# Altium project Digi_PID_Controller.PrjPcb
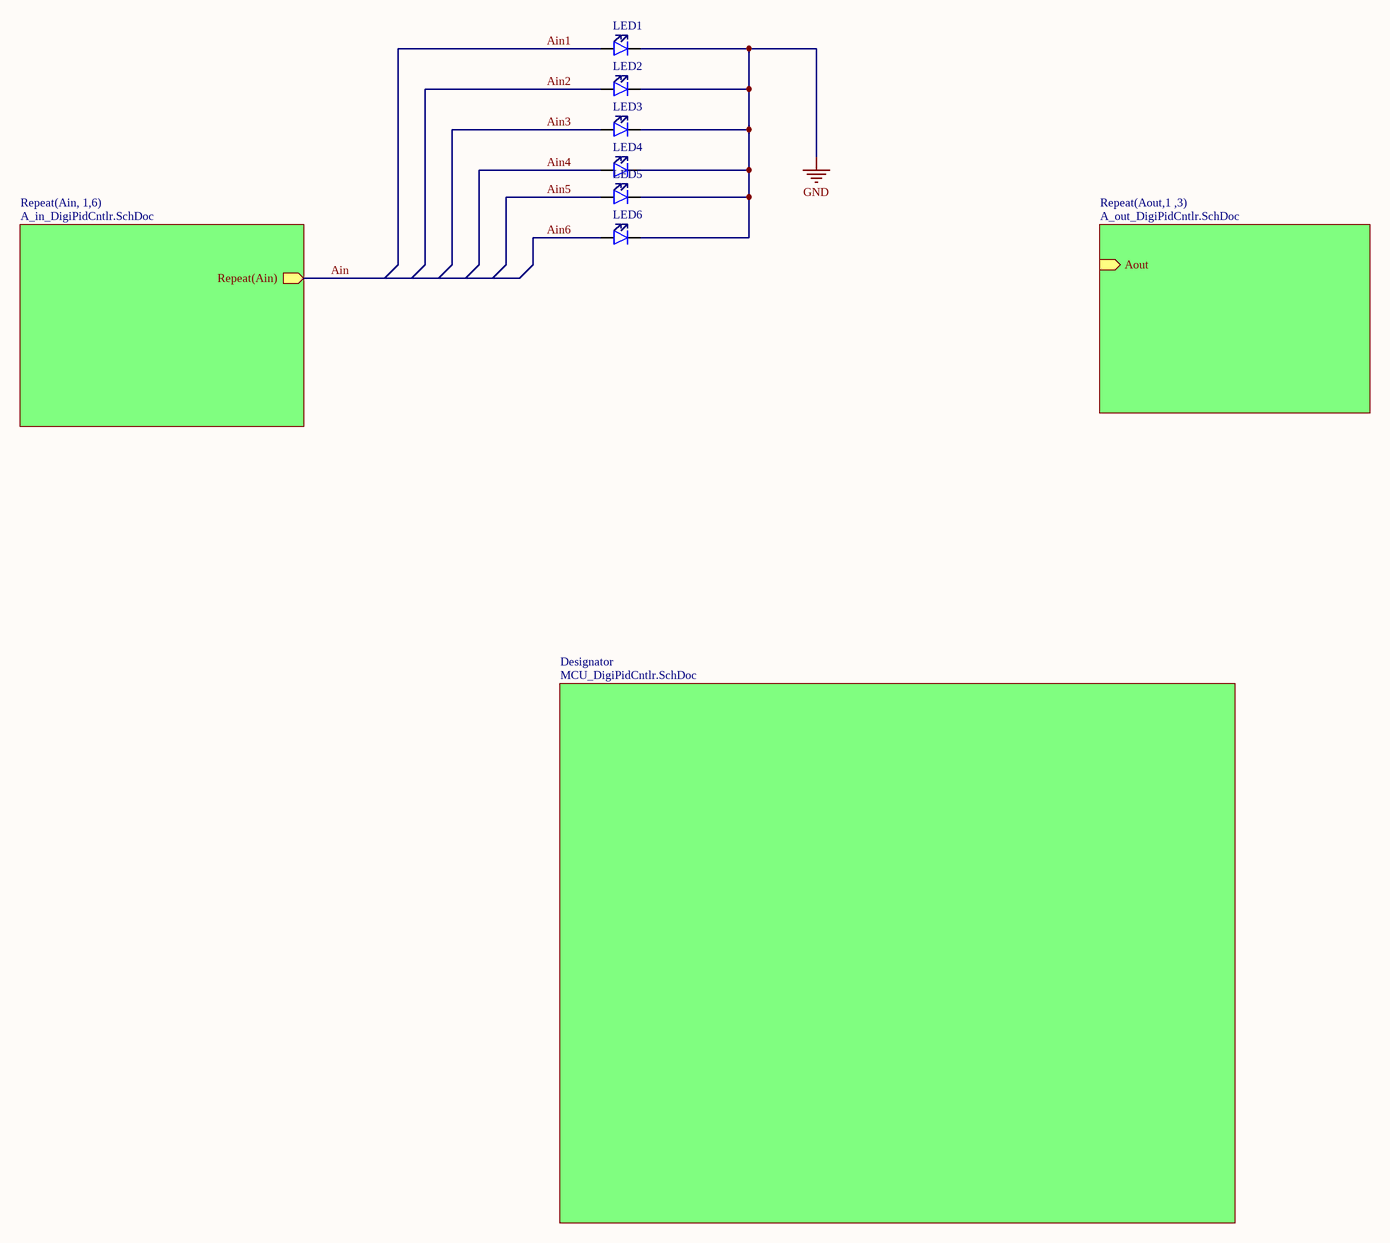
[diagram p0: Digi_PID_Cltr.SchDoc]
4 sheets, 16 parts. Net scope: hierarchical (ports join the sheet entries above them; power ports are global).
Board file: DigiPidCntlrPcbDoc.PcbDoc
Sheets:
  Digi_PID_Cltr.SchDoc
    Ain1 = A_in_DigiPidCntlr.SchDoc
    Ain2 = A_in_DigiPidCntlr.SchDoc
    Ain3 = A_in_DigiPidCntlr.SchDoc
    Ain4 = A_in_DigiPidCntlr.SchDoc
    Ain5 = A_in_DigiPidCntlr.SchDoc
    Ain6 = A_in_DigiPidCntlr.SchDoc
    Aout1 = A_out_DigiPidCntlr.SchDoc
    Aout2 = A_out_DigiPidCntlr.SchDoc
    Aout3 = A_out_DigiPidCntlr.SchDoc
    Designator = MCU_DigiPidCntlr.SchDoc

## Sheet Digi_PID_Cltr.SchDoc
size A3

### Parts
LED1  LED  [SMD LED 0805]  (value not drawn)
LED2  LED  [SMD LED 0805]  (value not drawn)
LED3  LED  [SMD LED 0805]  (value not drawn)
LED4  LED  [SMD LED 0805]  (value not drawn)
LED5  LED  [SMD LED 0805]  (value not drawn)
LED6  LED  [SMD LED 0805]  (value not drawn)

### Sub-sheets
Designator = MCU_DigiPidCntlr.SchDoc: no entries
Repeat(Ain, 1,6) = A_in_DigiPidCntlr.SchDoc: Repeat(Ain) (out)
Repeat(Aout,1 ,3) = A_out_DigiPidCntlr.SchDoc: Aout (in)

### Nets
GND: LED1.K LED2.K LED3.K LED4.K LED5.K LED6.K
Ain: sheet Repeat(Ain, 1,6)/Repeat(Ain)
Ain1: LED1.A
Ain2: LED2.A
Ain3: LED3.A
Ain4: LED4.A
Ain5: LED5.A
Ain6: LED6.A

### Library data of the parts
LED1-LED6 = LED: Color: *; Package: *; Comment_1: *

## Sheet A_in_DigiPidCntlr.SchDoc
size A4
Used 6 times, as channels Ain1, Ain2, Ain3, Ain4, Ain5, Ain6. Parts and nets are listed once, with the designators drawn on the sheet.
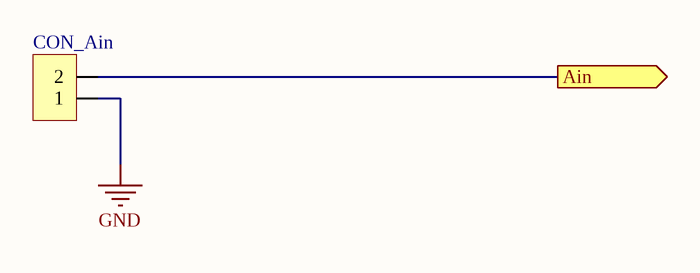
[diagram p1: A_in_DigiPidCntlr.SchDoc]

### Parts
CON_Ain  screw term 2 pin, 5.08mm  [MKDSN 1,5/ 2-5,08]  (value not drawn)

### Ports
Ain (out)

### Nets
GND: CON_Ain.1
Ain: CON_Ain.2 ; port Ain

### Channels
Ain1: designators end in _Ain1; ports Ain=Ain1
Ain2: designators end in _Ain2; ports Ain=Ain2
Ain3: designators end in _Ain3; ports Ain=Ain3
Ain4: designators end in _Ain4; ports Ain=Ain4
Ain5: designators end in _Ain5; ports Ain=Ain5
Ain6: designators end in _Ain6; ports Ain=Ain6

### Library data of the parts
CON_Ain = 2_pin_5.08mm

## Sheet A_out_DigiPidCntlr.SchDoc
size A4
Used 3 times, as channels Aout1, Aout2, Aout3. Parts and nets are listed once, with the designators drawn on the sheet.
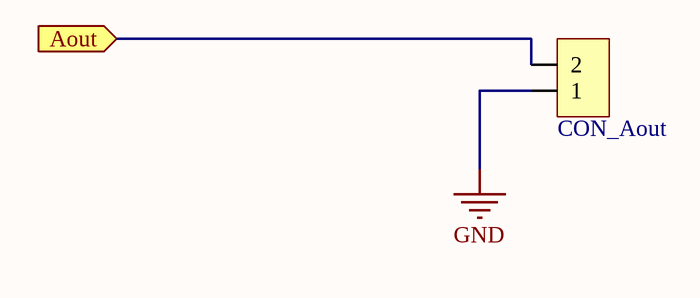
[diagram p2: A_out_DigiPidCntlr.SchDoc]

### Parts
CON_Aout  screw term 2 pin, 5.08mm  [MKDSN 1,5/ 2-5,08]  (value not drawn)

### Ports
Aout (in)

### Nets
GND: CON_Aout.1
Aout: CON_Aout.2 ; port Aout

### Channels
Aout1: designators end in _Aout1; ports Aout=NetCON_Aout_Aout1_2
Aout2: designators end in _Aout2; ports Aout=NetCON_Aout_Aout1_2
Aout3: designators end in _Aout3; ports Aout=NetCON_Aout_Aout1_2

### Library data of the parts
CON_Aout = 2_pin_5.08mm

## Sheet MCU_DigiPidCntlr.SchDoc
size A4
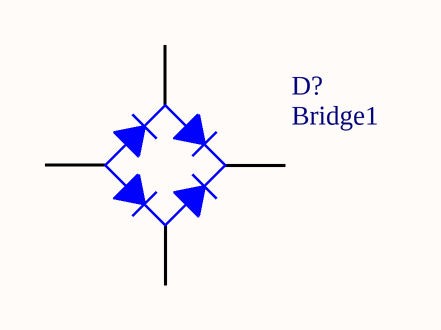
[diagram p3: MCU_DigiPidCntlr.SchDoc]

### Parts
D?  Bridge1  [D-38]

### Nets

Not connected (* = marked no-connect by the designer): D? 1(K) 2(C) 3(A) 4(C)

### Library data of the parts
D? = Bridge1: Full Wave Diode Bridge; Published: 8-Jun-2000; LatestRevisionDate: 29-May-2009; LatestRevisionNote: Sch pins A & K swapped.; DatasheetVersion: E2732B; PackageReference: D-38; Publisher: Altium Limited; PackageDescription: Bridge Rectifier; 4 Terminals; Body 9.4 x 9.4 mm (typ); Pitch 5.08 mm

## Nets that join several sheets
GND: Digi_PID_Cltr (6 pins), Ain1 (CON_Ain_Ain1.1), Ain2 (CON_Ain_Ain2.1), Ain3 (CON_Ain_Ain3.1), Ain4 (CON_Ain_Ain4.1), Ain5 (CON_Ain_Ain5.1), Ain6 (CON_Ain_Ain6.1), Aout1 (CON_Aout_Aout1.1), Aout2 (CON_Aout_Aout2.1), Aout3 (CON_Aout_Aout3.1)
Ain1: Digi_PID_Cltr (LED1.A), Ain1 (CON_Ain_Ain1.2)
Ain2: Digi_PID_Cltr (LED2.A), Ain2 (CON_Ain_Ain2.2)
Ain3: Digi_PID_Cltr (LED3.A), Ain3 (CON_Ain_Ain3.2)
Ain4: Digi_PID_Cltr (LED4.A), Ain4 (CON_Ain_Ain4.2)
Ain5: Digi_PID_Cltr (LED5.A), Ain5 (CON_Ain_Ain5.2)
Ain6: Digi_PID_Cltr (LED6.A), Ain6 (CON_Ain_Ain6.2)
NetCON_Aout_Aout1_2: Aout1 (CON_Aout_Aout1.2), Aout2 (CON_Aout_Aout2.2), Aout3 (CON_Aout_Aout3.2)